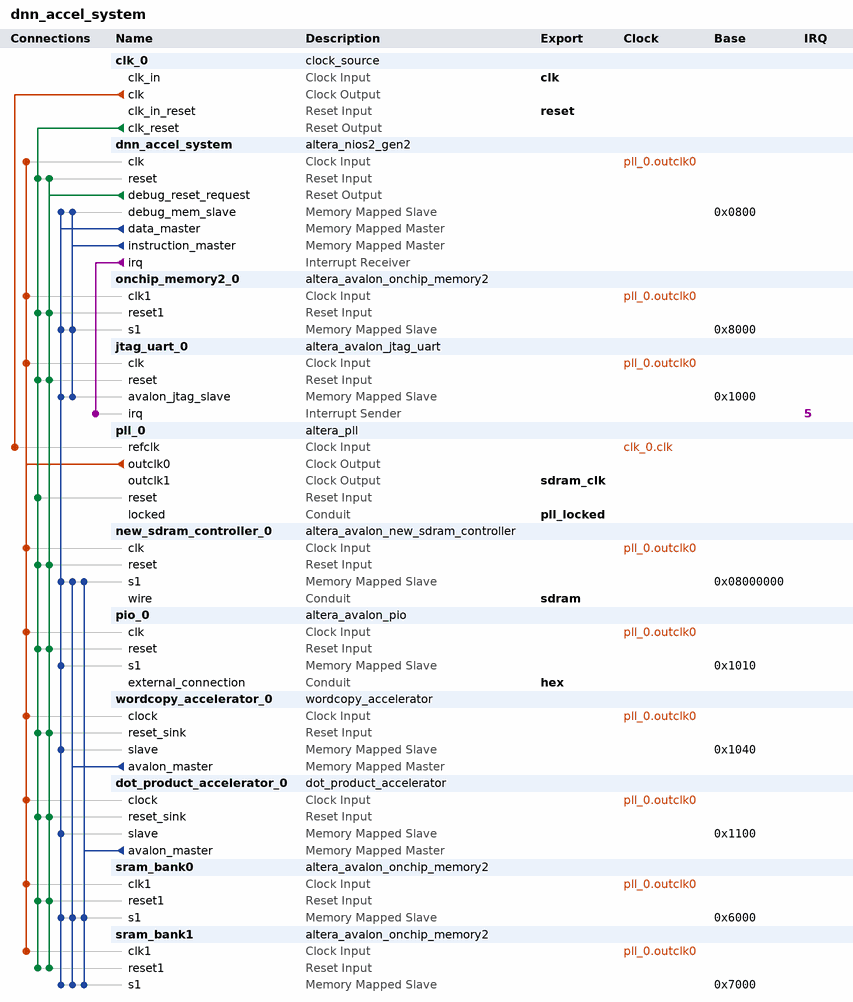
[diagram p0: system contents]
# Platform Designer (Qsys) system dnn_accel_system, Cyclone V 5CSEMA5F31C6
# Parameters at their usual value, and those the tool derives, are not listed.
package require -exact qsys 19.1
create_system dnn_accel_system
set_project_property DEVICE_FAMILY {Cyclone V}
set_project_property DEVICE 5CSEMA5F31C6

add_instance clk_0 clock_source 19.1
set_instance_parameter_value clk_0 clockFrequency 50000000

add_instance dnn_accel_system altera_nios2_gen2 19.1
set_instance_parameter_value dnn_accel_system dcache_size 2048
set_instance_parameter_value dnn_accel_system exceptionSlave onchip_memory2_0.s1
set_instance_parameter_value dnn_accel_system icache_size 4096
set_instance_parameter_value dnn_accel_system impl Tiny
set_instance_parameter_value dnn_accel_system resetSlave onchip_memory2_0.s1

add_instance onchip_memory2_0 altera_avalon_onchip_memory2 19.1
set_instance_parameter_value onchip_memory2_0 dataWidth 32
set_instance_parameter_value onchip_memory2_0 dualPort false
set_instance_parameter_value onchip_memory2_0 initMemContent true
set_instance_parameter_value onchip_memory2_0 initializationFileName onchip_mem.hex
set_instance_parameter_value onchip_memory2_0 memorySize 32768

add_instance jtag_uart_0 altera_avalon_jtag_uart 19.1
set_instance_parameter_value jtag_uart_0 simInteractiveOptions NO_INTERACTIVE_WINDOWS

add_instance pll_0 altera_pll 19.1
set_instance_parameter_value pll_0 gui_device_speed_grade 1
set_instance_parameter_value pll_0 gui_number_of_clocks 2
set_instance_parameter_value pll_0 gui_operation_mode direct
set_instance_parameter_value pll_0 gui_output_clock_frequency0 50.0
set_instance_parameter_value pll_0 gui_output_clock_frequency1 50.0
set_instance_parameter_value pll_0 gui_pll_mode {Integer-N PLL}
set_instance_parameter_value pll_0 gui_reference_clock_frequency 50.0
set_instance_parameter_value pll_0 gui_use_locked true

add_instance new_sdram_controller_0 altera_avalon_new_sdram_controller 19.1
set_instance_parameter_value new_sdram_controller_0 TAC 5.4
set_instance_parameter_value new_sdram_controller_0 TRCD 15.0
set_instance_parameter_value new_sdram_controller_0 TRP 15.0
set_instance_parameter_value new_sdram_controller_0 casLatency 3
set_instance_parameter_value new_sdram_controller_0 columnWidth 10
set_instance_parameter_value new_sdram_controller_0 dataWidth 16
set_instance_parameter_value new_sdram_controller_0 generateSimulationModel true
set_instance_parameter_value new_sdram_controller_0 model single_Micron_MT48LC4M32B2_7_chip
set_instance_parameter_value new_sdram_controller_0 numberOfBanks 4
set_instance_parameter_value new_sdram_controller_0 numberOfChipSelects 1
set_instance_parameter_value new_sdram_controller_0 powerUpDelay 100.0
set_instance_parameter_value new_sdram_controller_0 refreshPeriod 7.8125
set_instance_parameter_value new_sdram_controller_0 rowWidth 13

add_instance pio_0 altera_avalon_pio 19.1
set_instance_parameter_value pio_0 direction Output
set_instance_parameter_value pio_0 resetValue 127
set_instance_parameter_value pio_0 width 7

add_instance wordcopy_accelerator_0 wordcopy_accelerator 1.0

add_instance dot_product_accelerator_0 dot_product_accelerator 1.0

add_instance sram_bank0 altera_avalon_onchip_memory2 19.1
set_instance_parameter_value sram_bank0 dataWidth 32
set_instance_parameter_value sram_bank0 dualPort false
set_instance_parameter_value sram_bank0 initMemContent true
set_instance_parameter_value sram_bank0 initializationFileName onchip_mem.hex
set_instance_parameter_value sram_bank0 memorySize 4096

add_instance sram_bank1 altera_avalon_onchip_memory2 19.1
set_instance_parameter_value sram_bank1 dataWidth 32
set_instance_parameter_value sram_bank1 dualPort false
set_instance_parameter_value sram_bank1 initMemContent true
set_instance_parameter_value sram_bank1 initializationFileName onchip_mem.hex
set_instance_parameter_value sram_bank1 memorySize 4096

# connections
add_connection clk_0.clk pll_0.refclk clock
add_connection pll_0.outclk0 dnn_accel_system.clk clock
add_connection pll_0.outclk0 dot_product_accelerator_0.clock clock
add_connection pll_0.outclk0 jtag_uart_0.clk clock
add_connection pll_0.outclk0 new_sdram_controller_0.clk clock
add_connection pll_0.outclk0 onchip_memory2_0.clk1 clock
add_connection pll_0.outclk0 pio_0.clk clock
add_connection pll_0.outclk0 sram_bank0.clk1 clock
add_connection pll_0.outclk0 sram_bank1.clk1 clock
add_connection pll_0.outclk0 wordcopy_accelerator_0.clock clock
add_connection clk_0.clk_reset dnn_accel_system.reset reset
add_connection clk_0.clk_reset dot_product_accelerator_0.reset_sink reset
add_connection clk_0.clk_reset jtag_uart_0.reset reset
add_connection clk_0.clk_reset new_sdram_controller_0.reset reset
add_connection clk_0.clk_reset onchip_memory2_0.reset1 reset
add_connection clk_0.clk_reset pio_0.reset reset
add_connection clk_0.clk_reset pll_0.reset reset
add_connection clk_0.clk_reset sram_bank0.reset1 reset
add_connection clk_0.clk_reset sram_bank1.reset1 reset
add_connection clk_0.clk_reset wordcopy_accelerator_0.reset_sink reset
add_connection dnn_accel_system.debug_reset_request dnn_accel_system.reset reset
add_connection dnn_accel_system.debug_reset_request dot_product_accelerator_0.reset_sink reset
add_connection dnn_accel_system.debug_reset_request jtag_uart_0.reset reset
add_connection dnn_accel_system.debug_reset_request new_sdram_controller_0.reset reset
add_connection dnn_accel_system.debug_reset_request onchip_memory2_0.reset1 reset
add_connection dnn_accel_system.debug_reset_request pio_0.reset reset
add_connection dnn_accel_system.debug_reset_request sram_bank0.reset1 reset
add_connection dnn_accel_system.debug_reset_request sram_bank1.reset1 reset
add_connection dnn_accel_system.debug_reset_request wordcopy_accelerator_0.reset_sink reset
add_connection dnn_accel_system.data_master dnn_accel_system.debug_mem_slave avalon
set_connection_parameter_value dnn_accel_system.data_master/dnn_accel_system.debug_mem_slave baseAddress 0x0800
add_connection dnn_accel_system.data_master dot_product_accelerator_0.slave avalon
set_connection_parameter_value dnn_accel_system.data_master/dot_product_accelerator_0.slave baseAddress 0x1100
add_connection dnn_accel_system.data_master jtag_uart_0.avalon_jtag_slave avalon
set_connection_parameter_value dnn_accel_system.data_master/jtag_uart_0.avalon_jtag_slave baseAddress 0x1000
add_connection dnn_accel_system.data_master new_sdram_controller_0.s1 avalon
set_connection_parameter_value dnn_accel_system.data_master/new_sdram_controller_0.s1 baseAddress 0x08000000
add_connection dnn_accel_system.data_master onchip_memory2_0.s1 avalon
set_connection_parameter_value dnn_accel_system.data_master/onchip_memory2_0.s1 baseAddress 0x8000
add_connection dnn_accel_system.data_master pio_0.s1 avalon
set_connection_parameter_value dnn_accel_system.data_master/pio_0.s1 baseAddress 0x1010
add_connection dnn_accel_system.data_master sram_bank0.s1 avalon
set_connection_parameter_value dnn_accel_system.data_master/sram_bank0.s1 baseAddress 0x6000
add_connection dnn_accel_system.data_master sram_bank1.s1 avalon
set_connection_parameter_value dnn_accel_system.data_master/sram_bank1.s1 baseAddress 0x7000
add_connection dnn_accel_system.data_master wordcopy_accelerator_0.slave avalon
set_connection_parameter_value dnn_accel_system.data_master/wordcopy_accelerator_0.slave baseAddress 0x1040
add_connection dnn_accel_system.instruction_master dnn_accel_system.debug_mem_slave avalon
set_connection_parameter_value dnn_accel_system.instruction_master/dnn_accel_system.debug_mem_slave baseAddress 0x0800
add_connection dnn_accel_system.instruction_master jtag_uart_0.avalon_jtag_slave avalon
set_connection_parameter_value dnn_accel_system.instruction_master/jtag_uart_0.avalon_jtag_slave baseAddress 0x1000
add_connection dnn_accel_system.instruction_master onchip_memory2_0.s1 avalon
set_connection_parameter_value dnn_accel_system.instruction_master/onchip_memory2_0.s1 baseAddress 0x8000
add_connection dot_product_accelerator_0.avalon_master new_sdram_controller_0.s1 avalon
set_connection_parameter_value dot_product_accelerator_0.avalon_master/new_sdram_controller_0.s1 baseAddress 0x08000000
add_connection dot_product_accelerator_0.avalon_master sram_bank0.s1 avalon
set_connection_parameter_value dot_product_accelerator_0.avalon_master/sram_bank0.s1 baseAddress 0x6000
add_connection dot_product_accelerator_0.avalon_master sram_bank1.s1 avalon
set_connection_parameter_value dot_product_accelerator_0.avalon_master/sram_bank1.s1 baseAddress 0x7000
add_connection wordcopy_accelerator_0.avalon_master new_sdram_controller_0.s1 avalon
set_connection_parameter_value wordcopy_accelerator_0.avalon_master/new_sdram_controller_0.s1 baseAddress 0x08000000
add_connection wordcopy_accelerator_0.avalon_master sram_bank0.s1 avalon
set_connection_parameter_value wordcopy_accelerator_0.avalon_master/sram_bank0.s1 baseAddress 0x6000
add_connection wordcopy_accelerator_0.avalon_master sram_bank1.s1 avalon
set_connection_parameter_value wordcopy_accelerator_0.avalon_master/sram_bank1.s1 baseAddress 0x7000
add_connection dnn_accel_system.irq jtag_uart_0.irq interrupt
set_connection_parameter_value dnn_accel_system.irq/jtag_uart_0.irq irqNumber 5

# exported interfaces
add_interface clk clock sink
set_interface_property clk EXPORT_OF clk_0.clk_in
add_interface hex conduit end
set_interface_property hex EXPORT_OF pio_0.external_connection
add_interface pll_locked conduit end
set_interface_property pll_locked EXPORT_OF pll_0.locked
add_interface reset reset sink
set_interface_property reset EXPORT_OF clk_0.clk_in_reset
add_interface sdram conduit end
set_interface_property sdram EXPORT_OF new_sdram_controller_0.wire
add_interface sdram_clk clock source
set_interface_property sdram_clk EXPORT_OF pll_0.outclk1

set_interconnect_requirement {$system} qsys_mm.clockCrossingAdapter HANDSHAKE
set_interconnect_requirement {$system} qsys_mm.enableEccProtection FALSE
set_interconnect_requirement {$system} qsys_mm.insertDefaultSlave FALSE
set_interconnect_requirement {$system} qsys_mm.maxAdditionalLatency 1

save_system dnn_accel_system.qsys
